# EAGLE schematic OOBDpiZero (EAGLE 7.2.0)

## Sheet 1 of 3
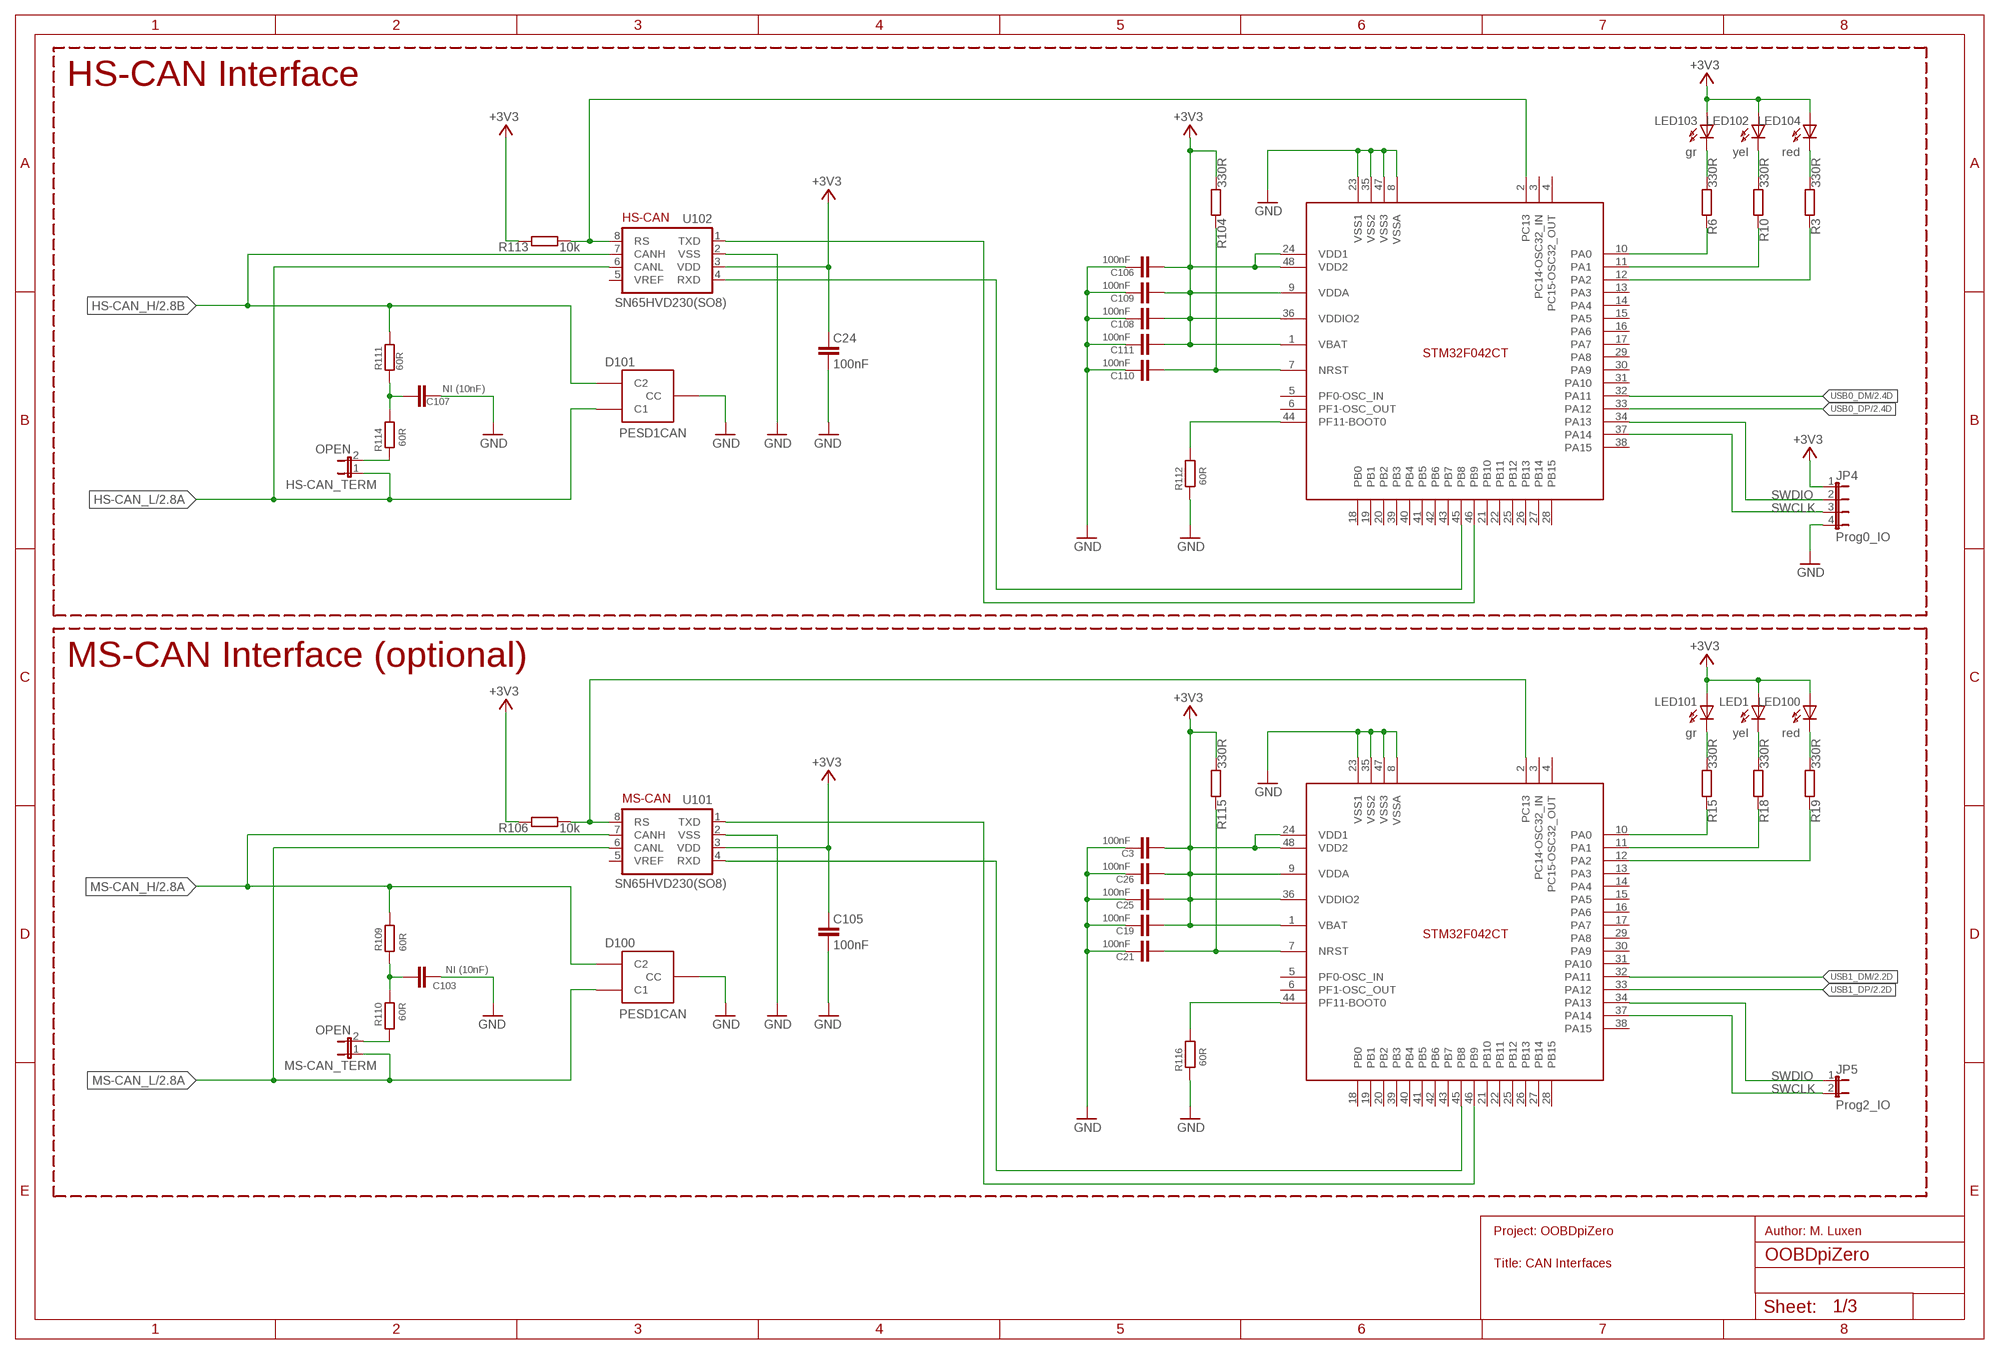
[diagram p0: schematic, sheet 1]

### Parts
C3  100nF  C-EUC0603  [C0603]
C19  100nF  C-EUC0603  [C0603]
C21  100nF  C-EUC0603  [C0603]
C24  100nF  C-EUC0603K  [C0603K]
C25  100nF  C-EUC0603  [C0603]
C26  100nF  C-EUC0603  [C0603]
C103  NI (10nF)  C-EUC0603  [C0603]
C105  100nF  C-EUC0603K  [C0603K]
C106  100nF  C-EUC0603  [C0603]
C107  NI (10nF)  C-EUC0603  [C0603]
C108  100nF  C-EUC0603  [C0603]
C109  100nF  C-EUC0603  [C0603]
C110  100nF  C-EUC0603  [C0603]
C111  100nF  C-EUC0603  [C0603]
D100  PESD1CAN  [SOT23]
D101  PESD1CAN  [SOT23]
HS-CAN_TERM  OPEN  JUMPER-2PTH  [1X02]
JP4  Prog0_IO  JP4E  [JP4]
JP5  Prog2_IO  JP1E  [JP1]
LED1  yel  LEDLED_0603  [LED_0603]
LED100  red  LEDLED_0603  [LED_0603]
LED101  gr  LEDLED_0603  [LED_0603]
LED102  yel  LEDLED_0603  [LED_0603]
LED103  gr  LEDLED_0603  [LED_0603]
LED104  red  LEDLED_0603  [LED_0603]
MS-CAN_TERM  OPEN  JUMPER-2PTH  [1X02]
R3  330R  R-EU_R0603  [R0603]
R6  330R  R-EU_R0603  [R0603]
R10  330R  R-EU_R0603  [R0603]
R15  330R  R-EU_R0603  [R0603]
R18  330R  R-EU_R0603  [R0603]
R19  330R  R-EU_R0603  [R0603]
R104  330R  R-EU_R0603  [R0603]
R106  10k  R-EU_R0603  [R0603]
R109  60R  R-EU_R0603  [R0603]
R110  60R  R-EU_R0603  [R0603]
R111  60R  R-EU_R0603  [R0603]
R112  60R  R-EU_R0603  [R0603]
R113  10k  R-EU_R0603  [R0603]
R114  60R  R-EU_R0603  [R0603]
R115  330R  R-EU_R0603  [R0603]
R116  60R  R-EU_R0603  [R0603]
U101  SN65HVD230(SO8)  MCP2551  [SO-08]
U102  SN65HVD230(SO8)  MCP2551  [SO-08]
U$100  STM32F042CT  [LQFP48]
U$102  STM32F042CT  [LQFP48]

### Nets
+3V3: C3.2 C19.2 C24.1 C25.2 C26.2 C105.1 C106.2 C108.2 C109.2 C111.2 JP4.1 LED1.A LED100.A LED101.A LED102.A LED103.A LED104.A R104.1 R106.2 R113.2 R115.1 U101.3(VDD) U102.3(VDD) U$100.1(VBAT) U$100.9(VDDA) U$100.24(VDD1) U$100.36(VDDIO2) U$100.48(VDD2) U$102.1(VBAT) U$102.9(VDDA) U$102.24(VDD1) U$102.36(VDDIO2) U$102.48(VDD2) ; also sheet 2,3
GND [PWR]: C3.1 C19.1 C21.1 C24.2 C25.1 C26.1 C103.2 C105.2 C106.1 C107.2 C108.1 C109.1 C110.1 C111.1 D100.3(CC) D101.3(CC) JP4.4 R112.2 R116.2 U101.2(VSS) U102.2(VSS) U$100.8(VSSA) U$100.23(VSS1) U$100.35(VSS2) U$100.47(VSS3) U$102.8(VSSA) U$102.23(VSS1) U$102.35(VSS2) U$102.47(VSS3) ; also sheet 2,3
HS-CAN_H: D101.2(C2) R111.2 U102.7(CANH) ; also sheet 2
HS-CAN_L: D101.1(C1) HS-CAN_TERM.1 U102.6(CANL) ; also sheet 2
HS-CAN_RXD: U102.4(RXD) U$100.45(PB8)
HS-CAN_TXD: U102.1(TXD) U$100.46(PB9)
MS-CAN_H: D100.2(C2) R109.2 U101.7(CANH) ; also sheet 2
MS-CAN_L: D100.1(C1) MS-CAN_TERM.1 U101.6(CANL) ; also sheet 2
MS-CAN_RXD: U101.4(RXD) U$102.45(PB8)
MS-CAN_TXD: U101.1(TXD) U$102.46(PB9)
N$2: C107.1 R111.1 R114.1
N$5: R113.1 U102.8(RS) U$100.2(PC13)
N$10: C103.1 R109.1 R110.1
N$13: R6.2 U$100.10(PA0)
N$14: R10.2 U$100.11(PA1)
N$15: R112.1 U$100.44(PF11-BOOT0)
N$16: R3.2 U$100.12(PA2)
N$17: LED104.C R3.1
N$18: LED102.C R10.1
N$19: LED103.C R6.1
N$20: C110.2 R104.2 U$100.7(NRST)
N$21: R116.1 U$102.44(PF11-BOOT0)
N$22: R15.2 U$102.10(PA0)
N$23: R18.2 U$102.11(PA1)
N$24: R19.2 U$102.12(PA2)
N$25: LED100.C R19.1
N$26: LED1.C R18.1
N$27: LED101.C R15.1
N$28: C21.2 R115.2 U$102.7(NRST)
N$30: HS-CAN_TERM.2 R114.2
N$32: MS-CAN_TERM.2 R110.2
N$80: R106.1 U101.8(RS) U$102.2(PC13)
SWCLK: JP4.3 JP5.2 U$100.37(PA14) U$102.37(PA14)
SWDIO: JP4.2 JP5.1 U$100.34(PA13) U$102.34(PA13)
USB0_DM: U$100.32(PA11) ; also sheet 2
USB0_DP: U$100.33(PA12) ; also sheet 2
USB1_DM: U$102.32(PA11) ; also sheet 2
USB1_DP: U$102.33(PA12) ; also sheet 2
Unconnected: U101.5(VREF) U102.5(VREF) U$100.3(PC14-OSC32_IN) U$100.4(PC15-OSC32_OUT) U$100.5(PF0-OSC_IN) U$100.6(PF1-OSC_OUT) U$100.13(PA3) U$100.14(PA4) U$100.15(PA5) U$100.16(PA6) U$100.17(PA7) U$100.18(PB0) U$100.19(PB1) U$100.20(PB2) U$100.21(PB10) U$100.22(PB11) U$100.25(PB12) U$100.26(PB13) U$100.27(PB14) U$100.28(PB15) U$100.29(PA8) U$100.30(PA9) U$100.31(PA10) U$100.38(PA15) U$100.39(PB3) U$100.40(PB4) U$100.41(PB5) U$100.42(PB6) U$100.43(PB7) U$102.3(PC14-OSC32_IN) U$102.4(PC15-OSC32_OUT) U$102.5(PF0-OSC_IN) U$102.6(PF1-OSC_OUT) U$102.13(PA3) U$102.14(PA4) U$102.15(PA5) U$102.16(PA6) U$102.17(PA7) U$102.18(PB0) U$102.19(PB1) U$102.20(PB2) U$102.21(PB10) U$102.22(PB11) U$102.25(PB12) U$102.26(PB13) U$102.27(PB14) U$102.28(PB15) U$102.29(PA8) U$102.30(PA9) U$102.31(PA10) U$102.38(PA15) U$102.39(PB3) U$102.40(PB4) U$102.41(PB5) U$102.42(PB6) U$102.43(PB7)

### Notes on the sheet
- HS-CAN Interface
- HS-CAN
- MS-CAN Interface (optional)
- DCAN0_TX
- DCAN0_RX
- MS-CAN
- Project: OOBDpiZero | Author: M. Luxen
- Title: CAN Interfaces

## Sheet 2 of 3
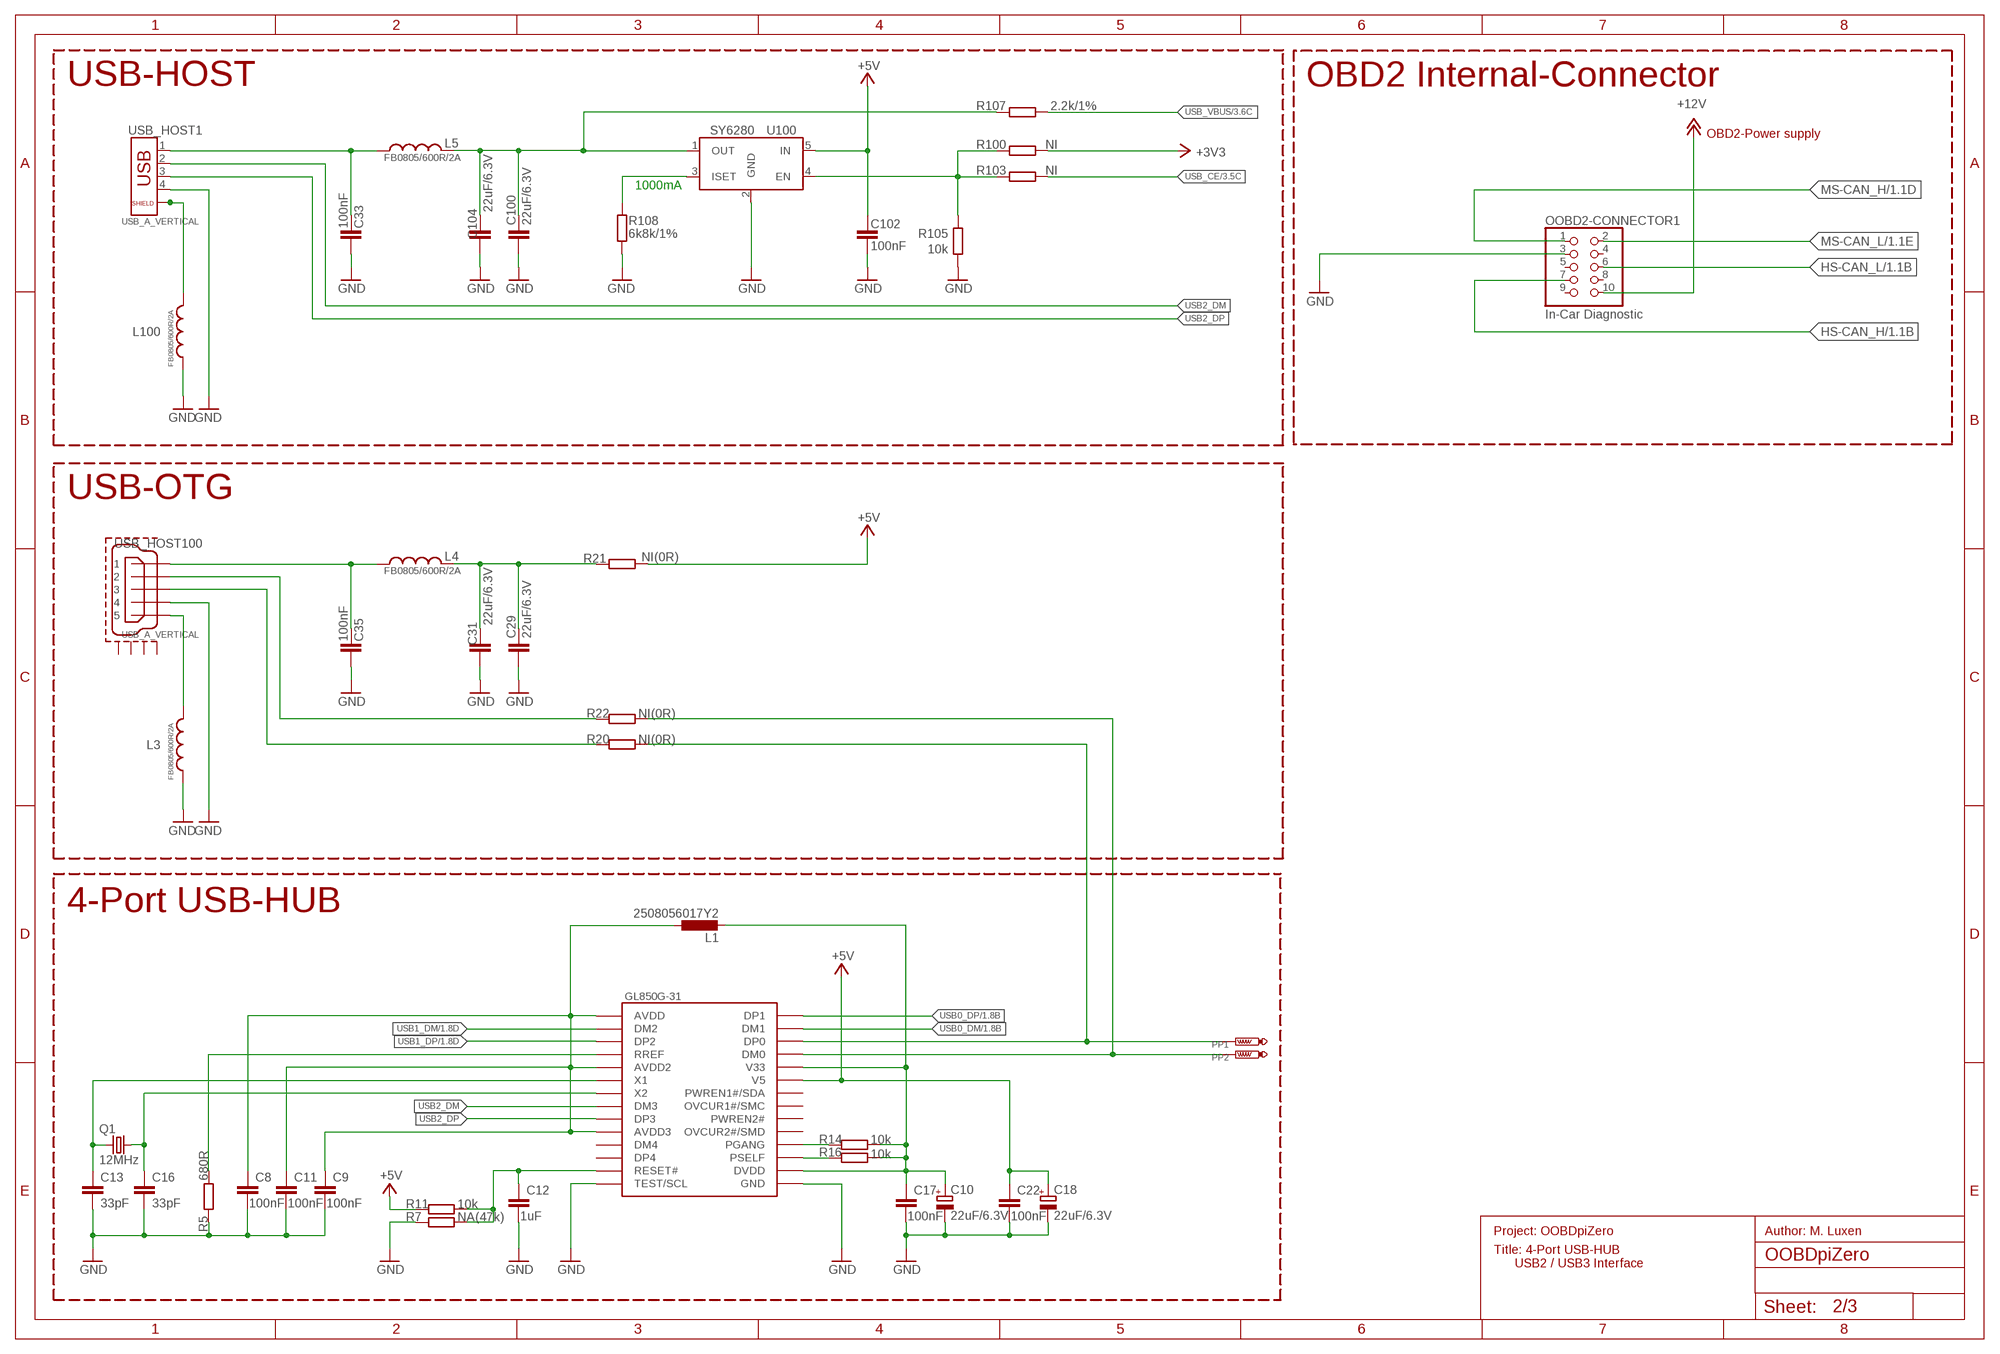
[diagram p1: schematic, sheet 2]

### Parts
C8  100nF  C-EUC0603  [C0603]
C9  100nF  C-EUC0603  [C0603]
C10  22uF/6.3V  CPOL-EUSMCA  [SMC_A]
C11  100nF  C-EUC0603  [C0603]
C12  1uF  C-EUC0603  [C0603]
C13  33pF  C-EUC0603  [C0603]
C16  33pF  C-EUC0603  [C0603]
C17  100nF  C-EUC0603  [C0603]
C18  22uF/6.3V  CPOL-EUSMCA  [SMC_A]
C22  100nF  C-EUC0603  [C0603]
C29  22uF/6.3V  C-EUC0603  [C0603]
C31  22uF/6.3V  C-EUC0603  [C0603]
C33  100nF  C-EUC0603K  [C0603K]
C35  100nF  C-EUC0603K  [C0603K]
C100  22uF/6.3V  C-EUC0603  [C0603]
C102  100nF  C-EUC0603K  [C0603K]
C104  22uF/6.3V  C-EUC0603  [C0603]
L1  2508056017Y2  L-EUL0805  [L0805@1]
L3  FB0805/600R/2A  L-USL0603  [L0603]
L4  FB0805/600R/2A  L-USL0603  [L0603]
L5  FB0805/600R/2A  L-USL0603  [L0603]
L100  FB0805/600R/2A  L-USL0603  [L0603]
OOBD2-CONNECTOR1  In-Car Diagnostic  PINHD-2X5/90  [2X05/90]
PP1  PTR1PAD1-11  [P1-11]
PP2  PTR1PAD1-11  [P1-11]
Q1  12MHz  CRYSTALSM49  [SM49]
R5  680R  R-EU_R0603  [R0603]
R7  NA(47k)  R-EU_R0603  [R0603]
R11  10k  R-EU_R0603  [R0603]
R14  10k  R-EU_R0603  [R0603]
R16  10k  R-EU_R0603  [R0603]
R20  NI(0R)  R-EU_R0603  [R0603]
R21  NI(0R)  R-EU_R0805  [R0805]
R22  NI(0R)  R-EU_R0603  [R0603]
R100  NI  R-EU_R0603  [R0603]
R103  NI  R-EU_R0603  [R0603]
R105  10k  R-EU_R0603  [R0603]
R107  2.2k/1%  R-EU_R0603  [R0603]
R108  6k8k/1%  R-EU_R0603  [R0603]
U100  SY6280  [SOT23-5]
U$101  GL850G-31  [TSSOP28]
USB_HOST1  USB_A_VERTICAL  USB_SHIELD1  [USB_PN87520_DEV_PTH]
USB_HOST100  USB_A_VERTICAL  MICRO-USB-RECEPTACLE47589-0001  [47589-0001]

### Nets
+3V3: R100.2 ; also sheet 1,3
+5V: C18.+ C22.1 C102.1 R11.1 R21.2 U100.5(IN) U$101.23(V5) ; also sheet 3
+12V: OOBD2-CONNECTOR1.10 ; also sheet 3
GND [PWR]: C8.2 C9.2 C10.- C11.2 C12.2 C13.2 C16.2 C17.2 C18.- C22.2 C29.2 C31.2 C33.2 C35.2 C100.2 C102.2 C104.2 L3.1 L100.1 OOBD2-CONNECTOR1.3 R5.1 R7.1 R105.1 R108.1 U100.2(GND) U$101.14(TEST/SCL) U$101.15(GND) USB_HOST1.4 USB_HOST100.4 ; also sheet 1,3
HS-CAN_H: OOBD2-CONNECTOR1.7 ; also sheet 1
HS-CAN_L: OOBD2-CONNECTOR1.6 ; also sheet 1
MS-CAN_H: OOBD2-CONNECTOR1.1 ; also sheet 1
MS-CAN_L: OOBD2-CONNECTOR1.2 ; also sheet 1
N$1: C29.1 C31.1 L4.1 R21.1
N$29: C16.1 Q1.2 U$101.7(X2)
N$31: C13.1 Q1.1 U$101.6(X1)
N$33: C10.+ C17.1 L1.2 R14.2 R16.2 U$101.16(DVDD) U$101.24(V33)
N$34: R14.1 U$101.18(PGANG)
N$35: R16.1 U$101.17(PSELF)
N$36: C12.1 R7.2 R11.2 U$101.13(RESET#)
N$38: R22.1 USB_HOST100.2
N$39: C8.1 C9.1 C11.1 L1.1 U$101.1(AVDD) U$101.5(AVDD2) U$101.10(AVDD3)
N$40: R5.2 U$101.4(RREF)
N$41: C33.1 L5.2 USB_HOST1.1
N$42: L100.2 USB_HOST1.P$1 USB_HOST1.P$2
N$43: R20.1 USB_HOST100.3
N$44: L3.2 USB_HOST100.5
N$45: R108.2 U100.3(ISET)
N$47: C100.1 C104.1 L5.1 R107.2 U100.1(OUT)
N$48: C35.1 L4.2 USB_HOST100.1
PP22: PP1.P$1(TP) R20.2 U$101.26(DP0)
PP23: PP2.P$1(TP) R22.2 U$101.25(DM0)
USB0_DM: U$101.27(DM1) ; also sheet 1
USB0_DP: U$101.28(DP1) ; also sheet 1
USB1_DM: U$101.2(DM2) ; also sheet 1
USB1_DP: U$101.3(DP2) ; also sheet 1
USB1_EN: R100.1 R103.1 R105.2 U100.4(EN)
USB2_DM: U$101.8(DM3) USB_HOST1.2
USB2_DP: U$101.9(DP3) USB_HOST1.3
USB_CE: R103.2 ; also sheet 3
USB_VBUS: R107.1 ; also sheet 3
Unconnected: OOBD2-CONNECTOR1.4 OOBD2-CONNECTOR1.5 OOBD2-CONNECTOR1.8 OOBD2-CONNECTOR1.9 U$101.11(DM4) U$101.12(DP4) U$101.19(OVCUR2#/SMD) U$101.20(PWREN2#) U$101.21(OVCUR1#/SMC) U$101.22(PWREN1#/SDA) USB_HOST100.CASING1(GND1) USB_HOST100.CASING2(GND2) USB_HOST100.CASING3(GND3) USB_HOST100.CASING4(GND4)

### Notes on the sheet
- USB-HOST | OBD2 Internal-Connector
- OBD2-Power supply
- 1000mA
- USB-OTG
- 4-Port USB-HUB
- Project: OOBDpiZero | Author: M. Luxen
- Title: 4-Port USB-HUB
        USB2 / USB3 Interface

## Sheet 3 of 3
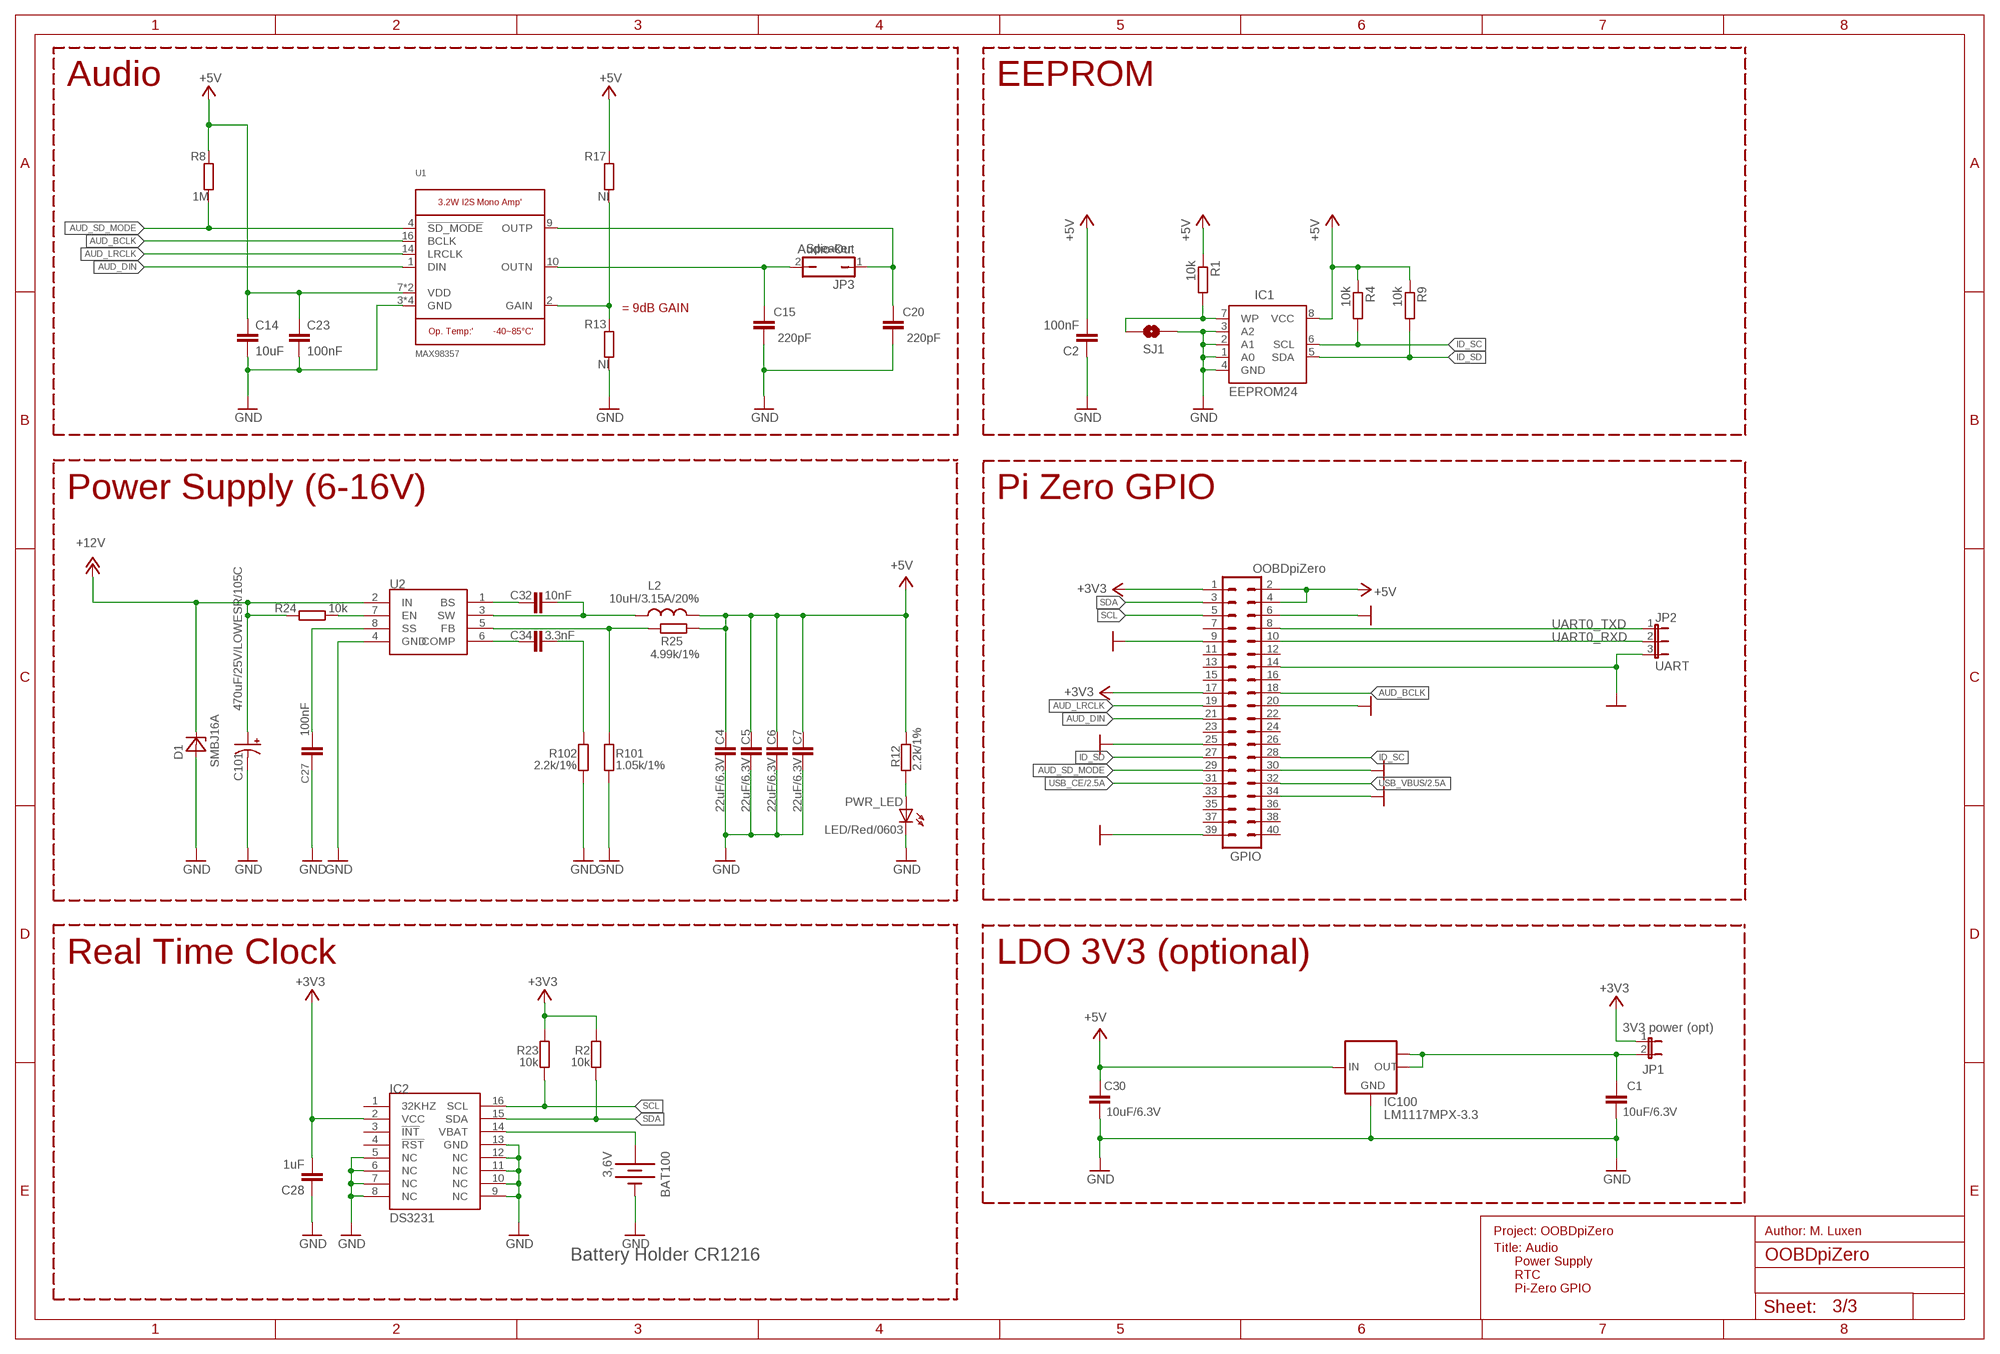
[diagram p2: schematic, sheet 3]

### Parts
BAT100  3,6V  BATTERY12PTH  [BATTCON_12MM_PTH]
C1  10uF/6.3V  C-EUC0603  [C0603]
C2  100nF  C-EUC0603  [C0603]
C4  22uF/6.3V  C-EUC0603  [C0603]
C5  22uF/6.3V  C-EUC0603  [C0603]
C6  22uF/6.3V  C-EUC0603  [C0603]
C7  22uF/6.3V  C-EUC0603  [C0603]
C14  10uF  C-EUC0805K  [C0805K]
C15  220pF  C-EUC0603K  [C0603K]
C20  220pF  C-EUC0603K  [C0603K]
C23  100nF  C-EUC0603K  [C0603K]
C27  100nF  C-EUC0603  [C0603]
C28  1uF  C-EUC0603  [C0603]
C30  10uF/6.3V  C-EUC0603  [C0603]
C32  10nF  C-EUC0603  [C0603]
C34  3.3nF  C-EUC0603  [C0603]
C101  470uF/25V/LOWESR/105C  47UF-50V-20%(ELECT)  [PANASONIC_D]
D1  SMBJ16A  [DO214AA]
GPIO  OOBDpiZero  PIZERO_THROUGH_HOLE  [PIZERO_THOUGH_HOLE]
IC1  EEPROM24  [SOIC8]
IC2  DS3231  DS3231SOIC-16W  [SOIC-16W]
IC100  LM1117MPX-3.3  [SOT223]
JP1  3V3 power (opt)  JP1E  [JP1]
JP2  UART  JP2E  [JP2]
JP3  Audio-Out  JP1Q  [JP1]
L2  10uH/3.15A/20%  LLQH88PN100M38  [8X8MM_3131]
PWR_LED  LED/Red/0603  LED0603DWS  [LED-0603]
R1  10k  R-EU_R0603  [R0603]
R2  10k  R-EU_R0603  [R0603]
R4  10k  R-EU_R0603  [R0603]
R8  1M  R-EU_R0603  [R0603]
R9  10k  R-EU_R0603  [R0603]
R12  2.2k/1%  R-EU_R0603  [R0603]
R13  NI  R-EU_R0603  [R0603]
R17  NI  R-EU_R0603  [R0603]
R23  10k  R-EU_R0603  [R0603]
R24  10k  R-EU_R0603  [R0603]
R25  4.99k/1%  R-EU_R0603  [R0603]
R101  1.05k/1%  R-EU_R0603  [R0603]
R102  2.2k/1%  R-EU_R0603  [R0603]
SJ1  SOLDERJUMPERTRACE  [SJ_2S-TRACE]
U1  MAX98357  AUDIOAMP_MAX98357  [QFN16_3MM]
U2  MP1482  [SOIC8]

### Nets
+3V3: C28.2 GPIO.1 GPIO.17 IC2.2(VCC) JP1.1 R2.1 R23.1 ; also sheet 1,2
+5V: C2.2 C4.1 C5.1 C6.1 C7.1 C14.1 C23.1 C30.1 GPIO.2 GPIO.4 IC1.8(VCC) IC100.3(IN) L2.2 R1.1 R4.1 R8.2 R9.1 R12.1 R17.2 R25.2 U1.7(VDD) U1.8(VDD) ; also sheet 2
+12V: C101.+ D1.C R24.1 U2.2(IN) ; also sheet 2
AUD_BCLK: GPIO.18 U1.16(BCLK)
AUD_DIN: GPIO.21 U1.1(DIN)
AUD_LRCLK: GPIO.19 U1.14(LRCLK)
AUD_SD_MODE: GPIO.29 R8.1 U1.4(!SD_MODE)
GND [PWR]: BAT100.GND(-) C1.2 C2.1 C4.2 C5.2 C6.2 C7.2 C14.2 C15.1 C20.1 C23.2 C27.2 C28.1 C30.2 C101.- D1.A GPIO.6 GPIO.9 GPIO.14 GPIO.20 GPIO.25 GPIO.30 GPIO.34 GPIO.39 IC1.1(A0) IC1.2(A1) IC1.3(A2) IC1.4(GND) IC2.5(NC) IC2.6(NC) IC2.7(NC) IC2.8(NC) IC2.9(NC) IC2.10(NC) IC2.11(NC) IC2.12(NC) IC2.13(GND) IC100.1(GND) JP2.3 PWR_LED.C R13.1 R101.2 R102.2 SJ1.1 U1.3(GND) U1.11(GND) U1.15(GND) U1.THERMAL(GND) U2.4(GND) ; also sheet 1,2
ID_SC: GPIO.28 IC1.6(SCL) R4.2
ID_SD: GPIO.27 IC1.5(SDA) R9.2
N$3: C15.2 JP3.2 U1.10(OUTN)
N$4: C27.1 U2.8(SS)
N$6: R24.2 U2.7(EN)
N$7: C32.1 U2.1(BS)
N$8: C32.2 L2.1 U2.3(SW)
N$9: C34.1 U2.6(COMP)
N$11: C34.2 R102.1
N$12: C20.2 JP3.1 U1.9(OUTP)
N$37: R13.2 R17.1 U1.2(GAIN)
N$46: IC1.7(WP) R1.2 SJ1.2
N$50: C1.1 IC100.2(OUT) IC100.TAB(OUT1) JP1.2
N$62: R25.1 R101.1 U2.5(FB)
N$129: PWR_LED.A R12.2
SCL: GPIO.5 IC2.16(SCL) R23.2
SDA: GPIO.3 IC2.15(SDA) R2.2
UART0_RXD: GPIO.10 JP2.2
UART0_TXD: GPIO.8 JP2.1
USB_CE: GPIO.31 ; also sheet 2
USB_VBUS: GPIO.32 ; also sheet 2
VBAT: BAT100.VCC@1(+) IC2.14(VBAT)
Unconnected: GPIO.7 GPIO.11 GPIO.12 GPIO.13 GPIO.15 GPIO.16 GPIO.22 GPIO.23 GPIO.24 GPIO.26 GPIO.33 GPIO.35 GPIO.36 GPIO.37 GPIO.38 GPIO.40 IC2.1(32KHZ) IC2.3(!INT) IC2.4(!RST)

### Notes on the sheet
- Audio | EEPROM
- Speaker
- = 9dB GAIN
- Power Supply (6-16V) | Pi Zero GPIO
- Ra
- Vout=0.923x(1+Ra/Rb)
- Rb
- Real Time Clock | LDO 3V3 (optional)
- Project: OOBDpiZero | Author: M. Luxen
- Battery Holder CR1216
- Title: Audio
        Power Supply
        RTC
        Pi-Zero GPIO

## Library data of the parts
BAT100 = SparkFun:BATTERY: Battery Holders Various common sizes : AA, AAA, 20mm coin cell and 12mm coin cell.
C1 C2 C4-C7 C14 C23 C24 C27-C35 C100 C102 C104 C105 = rcl:C-EU: CAPACITOR, European symbol
C3 C8 C9 C11-C13 C16 C17 C19 C21 C22 C25 C26 C103 C106-C111 = resistor:C-EU: CAPACITOR, European symbol
C10 C18 = rcl:CPOL-EU: POLARIZED CAPACITOR, European symbol
C15 C20 = rcl:C-EU: CAPACITOR, European symbol; MANEX: 123-0001115
C101 = SparkFun-Capacitors:47UF-50V-20%(ELECT): CAP-10547; PROD_ID: CAP-10547
D1 = OLIMEX_DISCRET:SMBJ16A
D100 D101 = Industrialberry:PESD1CAN
GPIO = pizero:PIZERO_THROUGH_HOLE
HS-CAN_TERM MS-CAN_TERM = SparkFun:JUMPER-2: Jumper Basic 0.1" spaced jumper. Use with breakaway headers.
IC1 = FLYFISH:EEPROM24
IC2 = DS3231_industrialberry:DS3231
IC100 = lm1117:LM1117MPX-*
JP1 JP5 = jumper:JP1E: JUMPER
JP2 = jumper:JP2E: JUMPER
JP3 = jumper:JP1Q: JUMPER
JP4 = jumper:JP4E: JUMPER
L1 = rcl:L-EU: INDUCTOR, European symbol
L2 = OLIMEX_DISCRET:L
L3-L5 L100 = rcl:L-US: INDUCTOR, American symbol
LED1 LED100-LED104 PWR_LED = DOUBLE-SIDE:LED
OOBD2-CONNECTOR1 = pinhead:PINHD-2X5: PIN HEADER
PP1 PP2 = testpad:PTR1: TEST PIN
Q1 = crystal:CRYSTAL: CRYSTAL; OC_FARNELL: unknown; OC_NEWARK: unknown
R1-R4 R6 R9 R10 R12 R15 R18 R19 R23-R25 R100-R108 R113 R115 = rcl:R-EU_: RESISTOR, European symbol
R5 R7 R11 R14 R16 R20-R22 R109-R112 R114 R116 = resistor:R-EU_: RESISTOR, European symbol
R8 R13 R17 = resistor:R-EU_: RESISTOR, European symbol; MANEX: 110-0002014
SJ1 = SparkFun:SOLDERJUMPER: Solder Jumper Standard SMD solder jumper. Used to automate production. Two varients : Normally Open and Normally Closed are the same, but have different paste layers. NC will have a large amount of paste and should jumper during reflow.
U1 = microbuilder:AUDIOAMP_MAX98357: MAX98357 - 3.2W I2S Mono Audio Amp
U2 = OLIMEX_IC:MP1482
U100 = OLIMEX_IC:SY6280
U101 U102 = arm:MCP2551
U$100 U$102 = micro-stm_v3:STM32F042C*T: STM32F042C*T
U$101 = pimoroni:GL850G-31
USB_HOST1 = OLIMEX_CONNECTORS:USB_SHIELD
USB_HOST100 = con-molex-usb:MICRO-USB-RECEPTACLE: MICRO USB RECEPTACLES Micro-USB Receptacles, SMT, Lead-Free from MOLEX <http://www.molex.com/>. (C) 2014 Tomasz Boleslaw CEDRO, cederom@tlen.pl, http://www.tomek.cedro.info. Version 0.1 (2014-01-17): Initial release. Version 0.2 (2014-02-06): Updated 47589-0001 footprint pins/pads/milling. Following devices are included: 1. 47589-0001 Micro-USB AB Receptacle, Bottom Mount, SMT, Lead-Free <http://www.molex.com/molex/products/datasheet.jsp?part=active/0475890001_IO_CONNECTORS.xml> (Technical Drawing <http://www.molex.com/pdm_docs/sd/475890001_sd.pdf>).

## Net classes
2 lan_sh: clearance 0.762 mm